# EAGLE design Eyecillator (EAGLE 9.5.1)
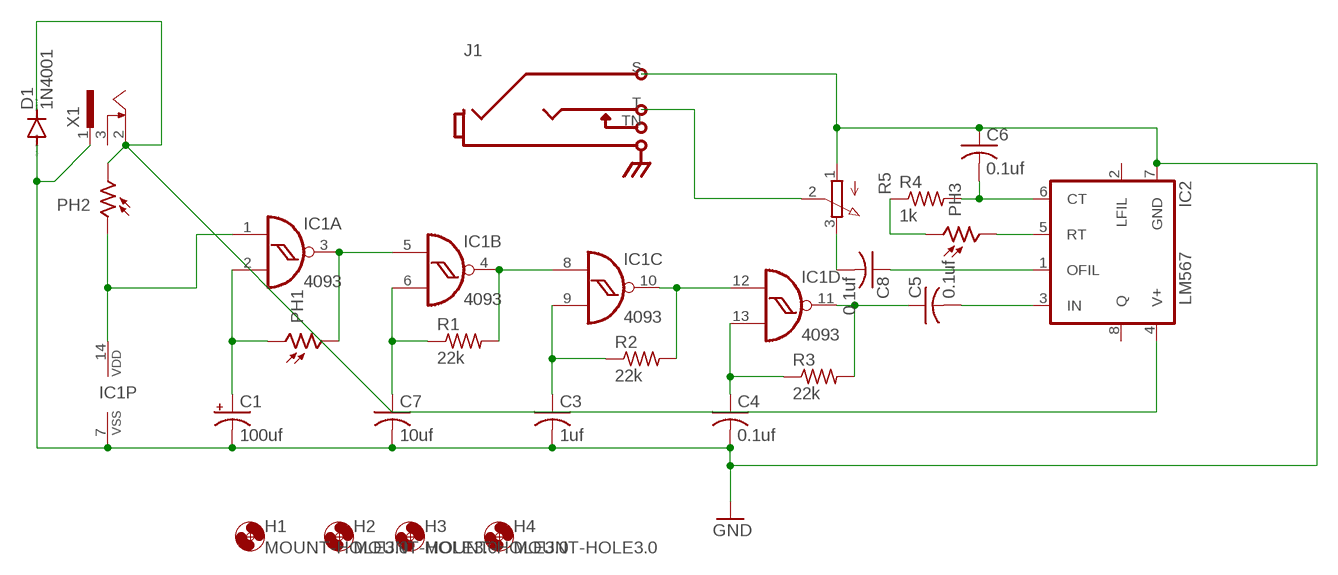
[diagram p0: schematic, sheet 1]

## Parts
C1  100uf  CPOL-USE2,5-6E  [E2,5-6E]
C3  1uf  C-US050-025X075  [C050-025X075]
C4  0.1uf  C-US050-025X075  [C050-025X075]
C5  0.1uf  C-US050-025X075  [C050-025X075]
C6  0.1uf  C-US050-025X075  [C050-025X075]
C7  10uf  C-US050-025X075  [C050-025X075]
C8  0.1uf  C-US050-025X075  [C050-025X075]
D1  1N4001  1N4004  [DO41-10]
H1  MOUNT-HOLE3.0  [3,0]
H2  MOUNT-HOLE3.0  [3,0]
H3  MOUNT-HOLE3.0  [3,0]
H4  MOUNT-HOLE3.0  [3,0]
IC1  4093  4093N  [DIL14]
IC2  LM567  LM567N  [DIL08]
J1  MONOSW1GND  [NEUTRIK-NRJ4HM-1]
PH1  VT90N1  [VT900]
PH2  VT90N1  [VT900]
PH3  VT90N1  [VT900]
R1  22k  R-US_0207/7  [0207/7]
R2  22k  R-US_0207/7  [0207/7]
R3  22k  R-US_0207/7  [0207/7]
R4  1k  R-US_0207/7  [0207/7]
R5  EVUF2L  [EVUFXL]
X1  SCD-014A  [SCD-014-A]

## Nets
GND: C1.- C3.2 C4.2 C6.1 C7.2 D1.A IC1.7(P:VSS) IC2.7(GND) J1.S R5.1(A) X1.1
N$1: IC1.3(A:O) IC1.5(B:I0) PH1.2
N$2: IC1.4(B:O) IC1.8(C:I0) R1.2
N$3: IC1.10(C:O) IC1.12(D:I0) R2.2
N$4: C1.+ IC1.2(A:I1) PH1.1
N$5: C7.1 IC1.6(B:I1) R1.1
N$6: C3.1 IC1.9(C:I1) R2.1
N$7: C4.1 IC1.13(D:I1) R3.1
N$8: C5.1 IC1.11(D:O) R3.2
N$9: IC1.1(A:I0) IC1.14(P:VDD) PH2.1
N$11: C5.2 IC2.3(IN)
N$12: C6.2 IC2.6(CT) R4.2
N$13: IC2.5(RT) PH3.2
N$14: PH3.1 R4.1
N$15: C8.1 IC2.1(OFIL)
N$16: C8.2 R5.3(E)
N$18: D1.C IC2.4(V+) PH2.2 X1.2
N$19: J1.T R5.2(S)
Unconnected: IC2.2(LFIL) IC2.8(Q) J1.TN X1.3

## Library data of the parts
C1 = rcl:CPOL-US: POLARIZED CAPACITOR, American symbol; SPICEPREFIX: C
C3-C8 = rcl:C-US: CAPACITOR, American symbol; SPICEPREFIX: C
D1 = diode:1N4004: DIODE general purpose rectifier, 1 A
H1-H4 = holes:MOUNT-HOLE: MOUNTING HOLE with drill center marker
IC1 = 40xx:4093: Quad 2-input NAND schmitt trigger
IC2 = linear3:*567: TONE DECODER
J1 = Audio Jacks 0.25 inch:MONOSW1GND: 1/4" mono jack, switched (unswitched sleeve), with chassis ground connection
PH1-PH3 = photo-elements:VT9: Photoconductive Cell VT900 Series Source: http://optoelectronics.perkinelmer.com/content/Datasheets/DTS_vt900seriesdatasheet.pdf
R1-R4 = rcl:R-US_: RESISTOR, American symbol; SPICEPREFIX: R
R5 = pot:EVU: 9 mm Square Rotary Potentiometers Source: Panasonic
X1 = con-shiua-chyuan:SCD-014A: Power Jack 2.5mm; OC_FARNELL: unknown; OC_NEWARK: unknown

## Board
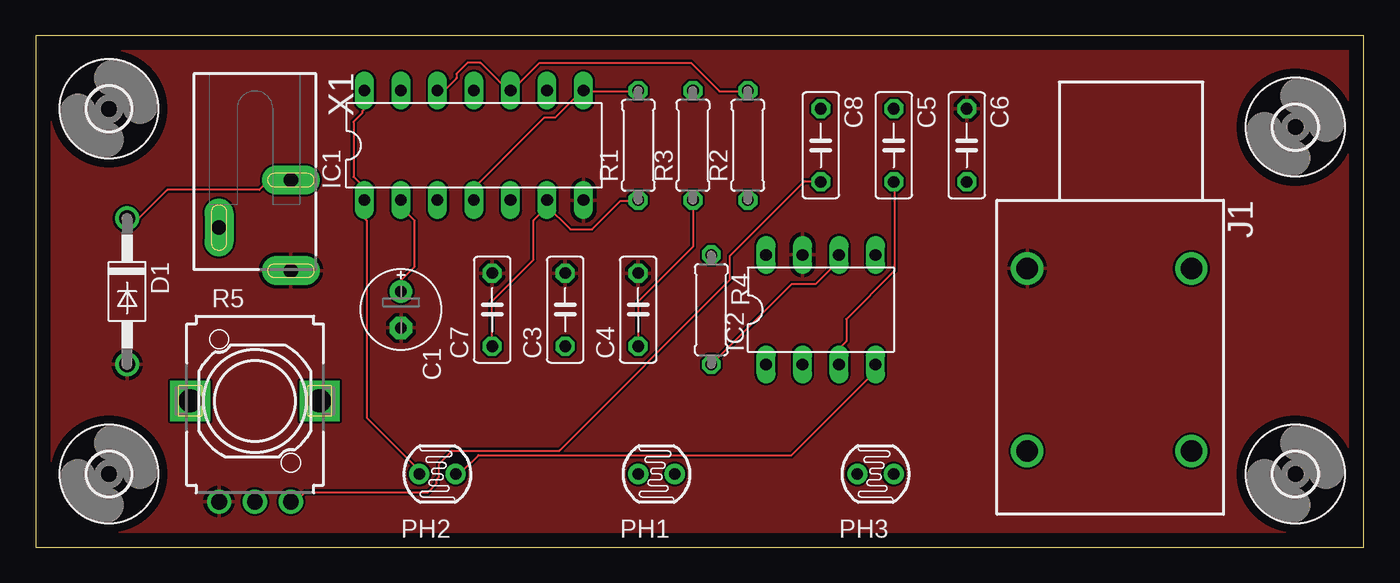
[diagram p1: board, top side]
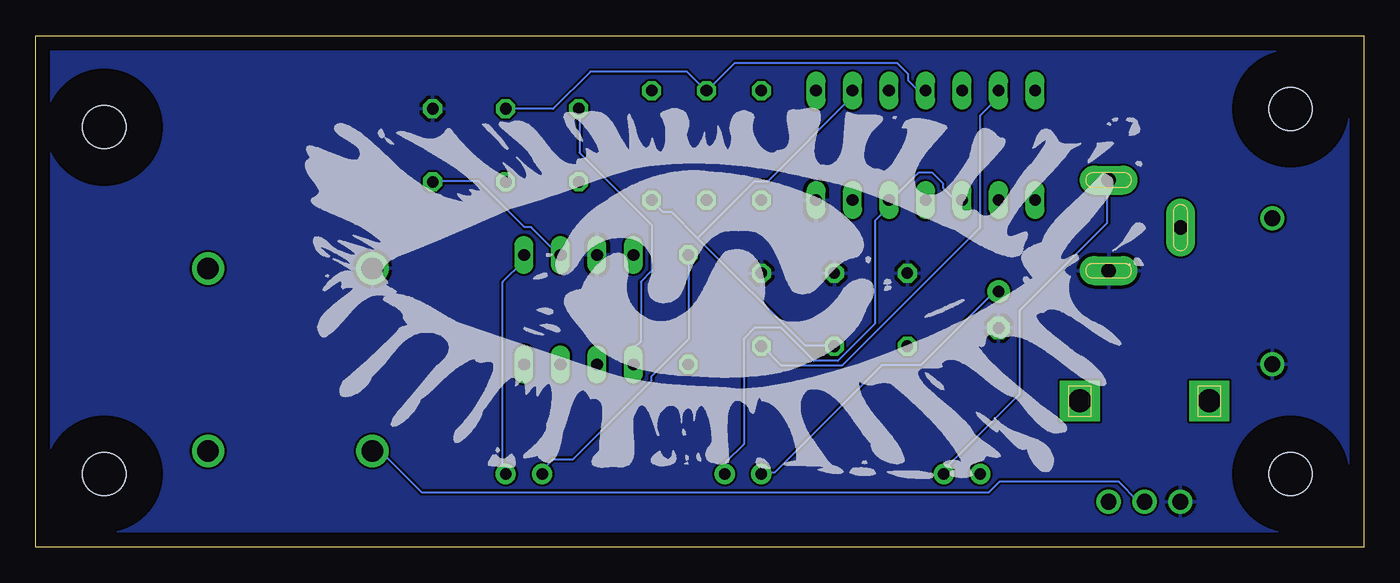
[diagram p2: board, bottom side, seen from below]

Size 92.38 x 35.55 mm. Coordinates in mm from the lower left corner, seen from the top.
Outline: 0,0 92.38,0 92.38,35.55 0,35.55 0,0
Copper layers (1*16): Top 0.035mm / dielectric 1.5mm / Bottom 0.035mm
Design rules "default": minimum track width 6mil, minimum drill 0.35mm, track to track 6mil, track to pad 6mil, pad to pad 6mil, via to via 6mil, smd to smd 6mil, copper to edge 40mil, drill to drill 6mil, minimum pad ring 10mil, minimum via ring 8mil, stop-mask expansion 4mil, vias tented up to drill 0mil, thermal gap 10mil

### Footprints (pad centres in the part's own frame; a part is rotated, then mirrored left to right if it is on the bottom)
E2,5-6E = drill 0.813 pad 1.575: + -1.27,0 | drill 0.813 pad 1.575 octagon: - 1.27,0
C050-025X075 = drill 0.813 octagon: 1 -2.54,0; 2 2.54,0
DO41-10 = drill 1.118: A 5.08,0; C -5.08,0
3,0 = hole 3: 0,0
DIL14 = drill 0.813 long: 1 -7.62,-3.81; 2 -5.08,-3.81; 3 -2.54,-3.81; 4 0,-3.81; 5 2.54,-3.81; 6 5.08,-3.81; 7 7.62,-3.81; 8 7.62,3.81; 9 5.08,3.81; 10 2.54,3.81; 11 0,3.81; 12 -2.54,3.81; 13 -5.08,3.81; 14 -7.62,3.81
DIL08 = drill 0.813 long: 1 -3.81,-3.81; 2 -1.27,-3.81; 3 1.27,-3.81; 4 3.81,-3.81; 5 3.81,3.81; 6 1.27,3.81; 7 -1.27,3.81; 8 -3.81,3.81
NEUTRIK-NRJ4HM-1 = drill 1.5: S 7.23,4.75; SN -4.2,4.75; T 7.23,17.45; TN -4.2,17.45
VT900 = drill 0.8 pad 1.4: 1 -1.27,0; 2 1.27,0
0207/7 = drill 0.813 octagon: 1 -3.81,0; 2 3.81,0
EVUFXL = drill 1.1 pad 1.676: 1 -2.5,-7; 2 0,-7; 3 2.5,-7 | drill 1.6 pad 2.8 square: M1 4.5,0; M2 -4.5,0
SCD-014-A = drill 1 pad 2 long: 1 -2.5,13.8; 2 -2.5,7.5; 3 2.5,10.8

### Placement (x,y rotation side)
C1  25.4,16.51 270 top
C3  36.83,16.51 90 top
C4  41.91,16.51 90 top
C5  59.69,27.94 270 top
C6  64.77,27.94 270 top
C7  31.75,16.51 90 top
C8  54.61,27.94 270 top
D1  6.35,17.78 270 top
H1  87.63,5.08 0 top
H2  87.63,29.21 0 top
H3  5.08,5.08 0 top
H4  5.08,30.48 0 top
IC1  30.48,27.94 0 top
IC2  54.61,16.51 0 top
J1  76.2,24.13 180 top
PH1  43.18,5.08 0 top
PH2  27.94,5.08 0 top
PH3  58.42,5.08 0 top
R1  41.91,27.94 90 top
R2  49.53,27.94 90 top
R3  45.72,27.94 90 top
R4  46.99,16.51 270 top
R5  15.24,10.16 0 top
X1  15.24,33.02 180 top

### Tracks (layer width: path | path; a pad name or v marks a point on that pad's centre or on a via)
GND
  pour Top: 0,35.56 92.71,35.56 92.71,0 0,0
  pour Bottom: 0,35.56 92.71,35.56 92.71,0 0,0
N$1
  Bottom 0.152: IC1.3 28.04,24.23 28.5,24.23 29.26,24.99 29.26,25.3 30.02,26.06 30.94,26.06 32.92,24.08 IC1.5 33.07,24.08 33.07,23.62 33.98,22.71 33.98,15.54 36.58,12.95 38.25,12.95 40.54,15.24 42.37,15.24 43.13,14.48 43.13,7.16 44.35,5.94 44.35,5.18 PH1.2
N$2
  Top 0.152: IC1.4 30.48,24.99 35.36,29.87 36.12,29.87 38.1,31.85 IC1.8 38.1,31.7 41.91,31.7 R1.2
N$3
  Top 0.152: IC1.12 28.04,31.85 28.5,31.85 29.26,32.61 29.26,32.92 30.02,33.68 30.94,33.68 32.92,31.7 IC1.10 33.07,31.7 35.05,33.68 45.57,33.68 47.55,31.7 49.53,31.7 R2.2
N$4
  Top 0.152: IC1.2 25.45,24.08 25.45,23.62 26.36,22.71 26.36,19.51 25.45,18.59 25.45,17.83 C1.+
  Bottom 0.152: PH1.1 41.91,5.18 41,5.18 33.53,12.65 30.79,12.65 25.76,17.68 25.45,17.68 C1.+
N$5
  Top 0.152: 35.51,23.77 35.51,24.08 IC1.6 35.51,23.77 | 35.51,23.77 35.51,23.62 34.59,22.71 34.59,19.96 31.7,17.07 31.7,14.02 C7.1 | 35.51,23.77 37.19,22.1 38.71,22.1 40.69,24.08 41.91,24.08 R1.1
N$6
  Bottom 0.152: 46.33,21.49 48.16,23.32 48.77,23.32 49.53,24.08 R2.1 | 46.33,21.49 38.86,14.02 36.88,14.02 C3.1 | 46.33,21.49 42.37,25.45 41.45,25.45 35.66,31.24 35.66,31.7 IC1.9
N$7
  Top 0.152: C4.1 41.91,17.07 45.72,20.88 R3.1
  Bottom 0.152: IC1.13 25.45,31.7 25.45,31.24 26.67,30.02 26.67,22.25 36.27,12.65 40.54,12.65 41.91,14.02 C4.1
N$8
  Bottom 0.152: 45.72,31.7 43.74,33.68 32.46,33.68 31.7,32.92 31.7,32.46 31.09,31.85 30.48,31.85 IC1.11 | C5.1 56.39,30.48 53.8,33.07 47.09,33.07 45.72,31.7 | 45.72,31.7 R3.2
N$9
  Top 0.152: IC1.14 22.86,30.48 22.71,30.33 22.71,30.18 22.1,29.57 22.1,25.76 22.86,24.99 IC1.1 22.86,22.86 23.01,22.71 23.01,8.99 26.36,5.64 26.36,5.49 26.67,5.18 PH2.1
N$11
  Top 0.152: IC2.3 55.93,12.8 55.93,13.87 56.39,14.33 56.39,15.85 59.74,19.2 59.74,25.3 C5.2
N$12
  Top 0.152: R4.2 52.58,18.29 54.25,18.29 55.78,19.81 55.78,20.27 IC2.6
  Bottom 0.152: C6.2 64.77,25.45 61.57,25.45 58.37,22.25 57.91,22.25 55.93,20.27 IC2.6
N$13
  Bottom 0.152: IC2.5 58.52,20.27 58.52,19.81 59.89,18.44 59.89,5.33 59.74,5.18 PH3.2
N$14
  Bottom 0.152: PH3.1 57.15,5.33 56.39,6.1 55.02,6.1 49.53,11.58 49.53,11.89 46.94,14.48 46.94,20.27 R4.1
N$15
  Bottom 0.152: IC2.1 50.75,12.8 50.75,13.87 50.29,14.33 50.29,18.44 49.53,19.2 49.53,22.4 54.56,27.43 54.56,30.48 C8.1
N$16
  Top 0.152: C8.2 54.56,25.45 53.49,25.45 48.31,20.27 48.31,18.59 36.42,6.71 28.96,6.71 28.04,5.79 28.04,4.88 27.89,4.72 27.89,4.42 27.28,3.81 18.75,3.81 18.14,3.2 17.83,3.2 R5.3
N$18
  Top 0.152: D1.C 7.16,22.86 9.14,24.84 15.54,24.84 16.15,25.45 17.68,25.45 X1.2 | IC2.4 58.37,12.65 58.37,12.19 52.58,6.4 30.79,6.4 29.57,5.18 29.26,5.18 PH2.2
  Bottom 0.152: X1.2 17.83,25.45 17.83,22.55 23.93,16.46 23.93,10.67 29.11,5.49 29.11,5.18 PH2.2
N$19
  Bottom 0.152: R5.2 15.24,3.2 15.7,3.2 17.07,4.57 25.3,4.57 26.06,3.81 65.53,3.81 68.28,6.55 68.89,6.55 J1.T

### Text on the board
tValues: VauxFlores | Eyecillator